# EAGLE schematic Tubes (EAGLE 7.5.0)
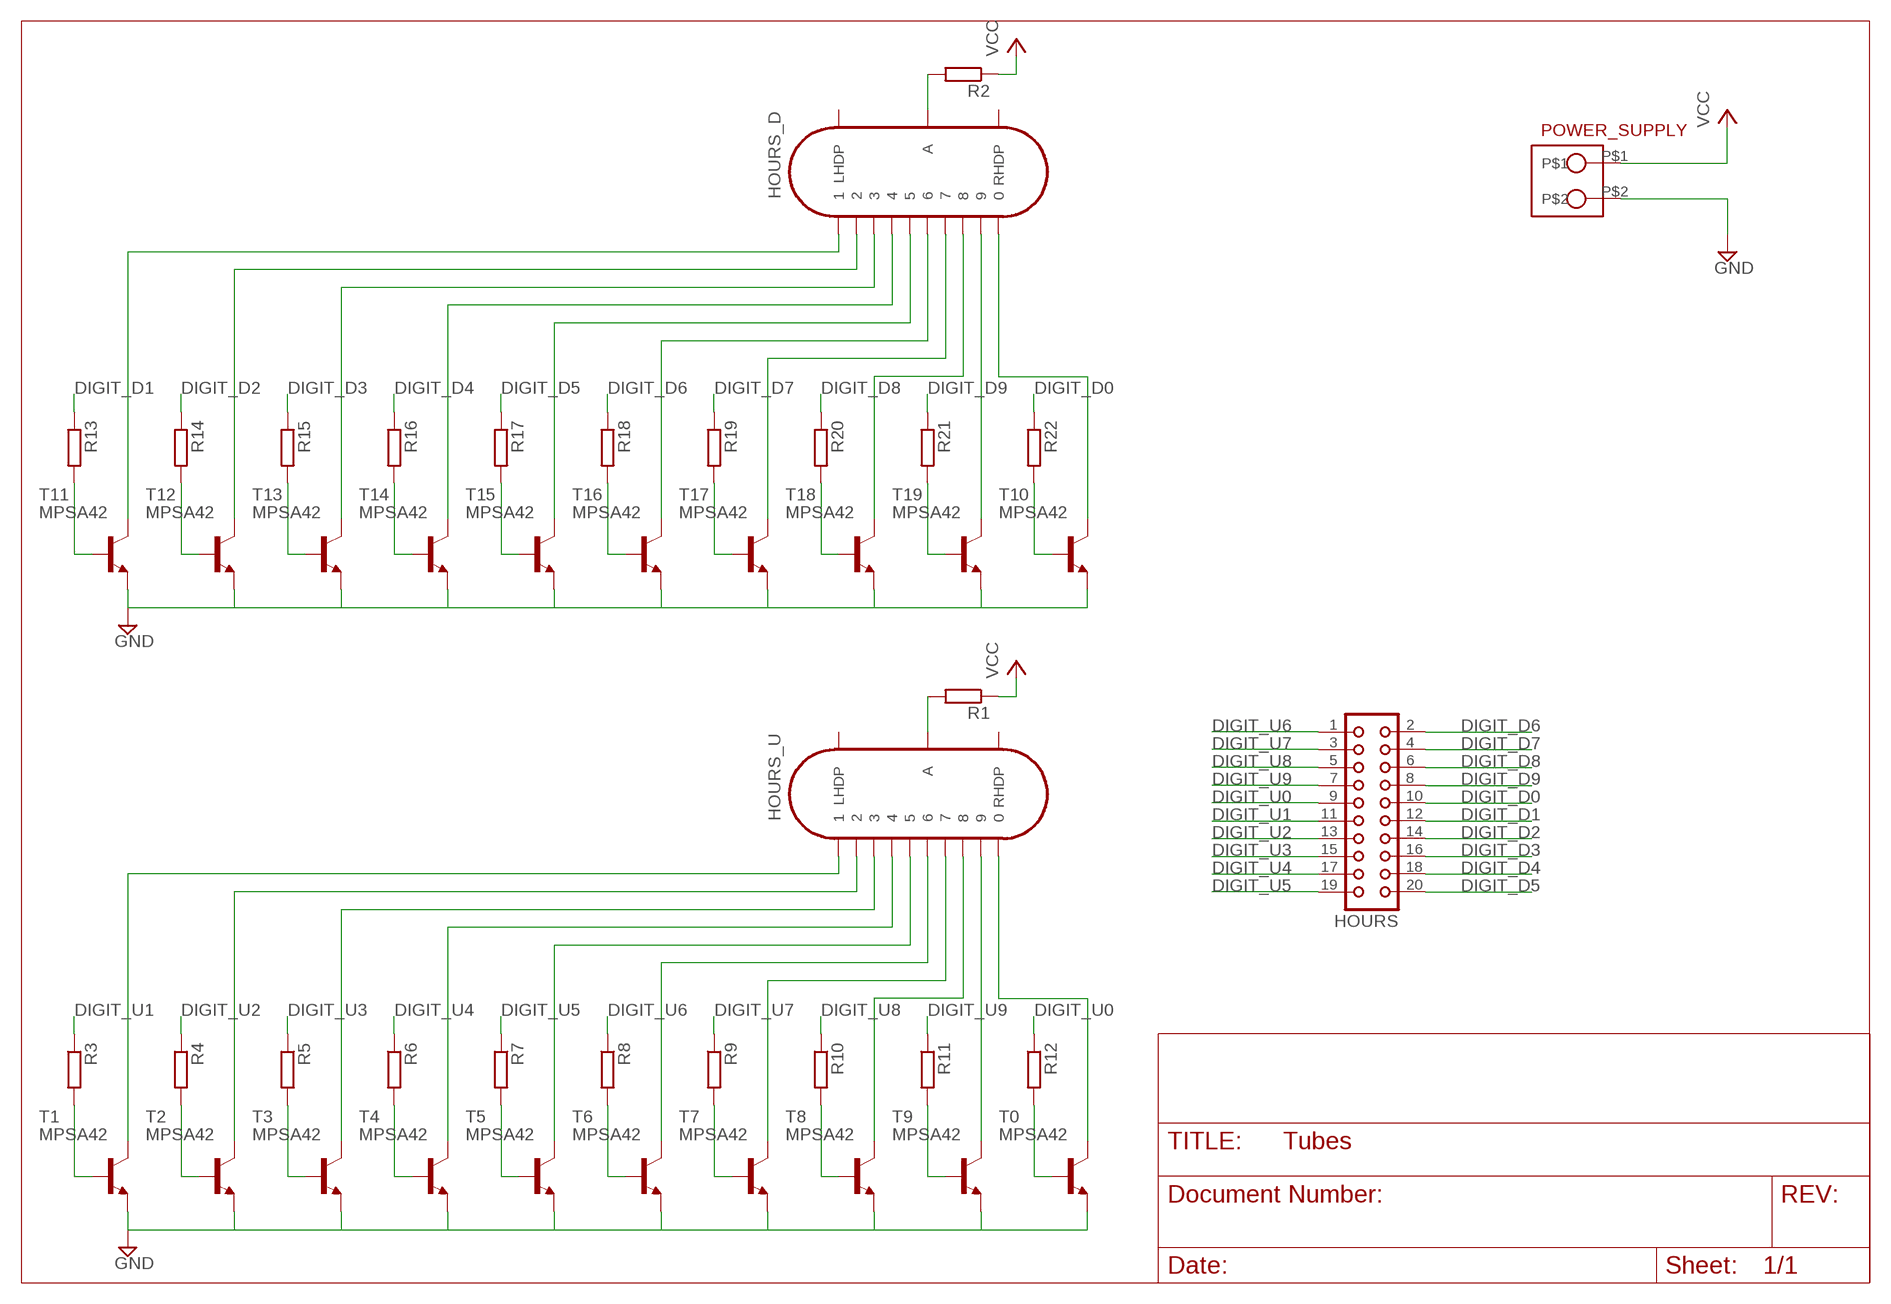
[diagram p0: schematic, sheet 1]

## Parts
HOURS  CON20  [CON20]
HOURS_D  IN-14  [IN-14]
HOURS_U  IN-14  [IN-14]
POWER_SUPPLY  CON_2_SIL  [SIL_2_0.2INCH]
R1  R-EU_0207/10  [0207/10]
R2  R-EU_0207/10  [0207/10]
R3  R-EU_0207/10  [0207/10]
R4  R-EU_0207/10  [0207/10]
R5  R-EU_0207/10  [0207/10]
R6  R-EU_0207/10  [0207/10]
R7  R-EU_0207/10  [0207/10]
R8  R-EU_0207/10  [0207/10]
R9  R-EU_0207/10  [0207/10]
R10  R-EU_0207/10  [0207/10]
R11  R-EU_0207/10  [0207/10]
R12  R-EU_0207/10  [0207/10]
R13  R-EU_0207/10  [0207/10]
R14  R-EU_0207/10  [0207/10]
R15  R-EU_0207/10  [0207/10]
R16  R-EU_0207/10  [0207/10]
R17  R-EU_0207/10  [0207/10]
R18  R-EU_0207/10  [0207/10]
R19  R-EU_0207/10  [0207/10]
R20  R-EU_0207/10  [0207/10]
R21  R-EU_0207/10  [0207/10]
R22  R-EU_0207/10  [0207/10]
T0  MPSA42  [TO92]
T1  MPSA42  [TO92]
T2  MPSA42  [TO92]
T3  MPSA42  [TO92]
T4  MPSA42  [TO92]
T5  MPSA42  [TO92]
T6  MPSA42  [TO92]
T7  MPSA42  [TO92]
T8  MPSA42  [TO92]
T9  MPSA42  [TO92]
T10  MPSA42  [TO92]
T11  MPSA42  [TO92]
T12  MPSA42  [TO92]
T13  MPSA42  [TO92]
T14  MPSA42  [TO92]
T15  MPSA42  [TO92]
T16  MPSA42  [TO92]
T17  MPSA42  [TO92]
T18  MPSA42  [TO92]
T19  MPSA42  [TO92]

## Nets
DIGIT_D0: HOURS.10 R22.1
DIGIT_D1: HOURS.12 R13.1
DIGIT_D2: HOURS.14 R14.1
DIGIT_D3: HOURS.16 R15.1
DIGIT_D4: HOURS.18 R16.1
DIGIT_D5: HOURS.20 R17.1
DIGIT_D6: HOURS.2 R18.1
DIGIT_D7: HOURS.4 R19.1
DIGIT_D8: HOURS.6 R20.1
DIGIT_D9: HOURS.8 R21.1
DIGIT_U0: HOURS.9 R12.1
DIGIT_U1: HOURS.11 R3.1
DIGIT_U2: HOURS.13 R4.1
DIGIT_U3: HOURS.15 R5.1
DIGIT_U4: HOURS.17 R6.1
DIGIT_U5: HOURS.19 R7.1
DIGIT_U6: HOURS.1 R8.1
DIGIT_U7: HOURS.3 R9.1
DIGIT_U8: HOURS.5 R10.1
DIGIT_U9: HOURS.7 R11.1
GND: POWER_SUPPLY.P$2 T0.1(E) T1.1(E) T2.1(E) T3.1(E) T4.1(E) T5.1(E) T6.1(E) T7.1(E) T8.1(E) T9.1(E) T10.1(E) T11.1(E) T12.1(E) T13.1(E) T14.1(E) T15.1(E) T16.1(E) T17.1(E) T18.1(E) T19.1(E)
N$1: HOURS_U.0 T0.3(C)
N$2: HOURS_U.9 T9.3(C)
N$3: R7.2 T5.2(B)
N$4: R8.2 T6.2(B)
N$5: R9.2 T7.2(B)
N$6: R12.2 T0.2(B)
N$7: R3.2 T1.2(B)
N$8: R5.2 T3.2(B)
N$9: R4.2 T2.2(B)
N$10: R6.2 T4.2(B)
N$11: R10.2 T8.2(B)
N$12: R11.2 T9.2(B)
N$13: HOURS_U.8 T8.3(C)
N$14: HOURS_U.7 T7.3(C)
N$15: HOURS_U.6 T6.3(C)
N$16: HOURS_U.5 T5.3(C)
N$17: HOURS_U.1 T1.3(C)
N$18: HOURS_U.4 T4.3(C)
N$19: HOURS_U.2 T2.3(C)
N$20: HOURS_D.0 T10.3(C)
N$21: HOURS_U.3 T3.3(C)
N$22: HOURS_D.9 T19.3(C)
N$23: HOURS_U.A R1.2
N$24: HOURS_D.8 T18.3(C)
N$25: HOURS_D.7 T17.3(C)
N$26: HOURS_D.6 T16.3(C)
N$27: HOURS_D.5 T15.3(C)
N$28: HOURS_D.2 T12.3(C)
N$29: HOURS_D.A R2.2
N$30: HOURS_D.3 T13.3(C)
N$31: HOURS_D.4 T14.3(C)
N$32: HOURS_D.1 T11.3(C)
N$33: R17.2 T15.2(B)
N$34: R18.2 T16.2(B)
N$35: R19.2 T17.2(B)
N$36: R22.2 T10.2(B)
N$37: R13.2 T11.2(B)
N$38: R15.2 T13.2(B)
N$39: R14.2 T12.2(B)
N$40: R16.2 T14.2(B)
N$41: R20.2 T18.2(B)
N$42: R21.2 T19.2(B)
VCC: POWER_SUPPLY.P$1 R1.1 R2.1
Unconnected: HOURS_D.LHDP HOURS_D.RHDP HOURS_U.LHDP HOURS_U.RHDP

## Library data of the parts
HOURS = con-harting:CON20: CONNECTOR; OC_FARNELL: unknown; OC_NEWARK: unknown
HOURS_D HOURS_U = russian-nixies:IN-14: IN-14: medium numeric frontview nixie tube
POWER_SUPPLY = PGT:CON_2_SIL: Connecteur à 2 pattes, avec un écart de 0.2 inc (soit 5.08 mm).
R1-R22 = resistor:R-EU_: RESISTOR, European symbol
T0 T1-T19 = PGT:MPSA42: NPN TRANSISTOR